# EAGLE design SpiCurrent-wimpy (EAGLE 7.2.0)
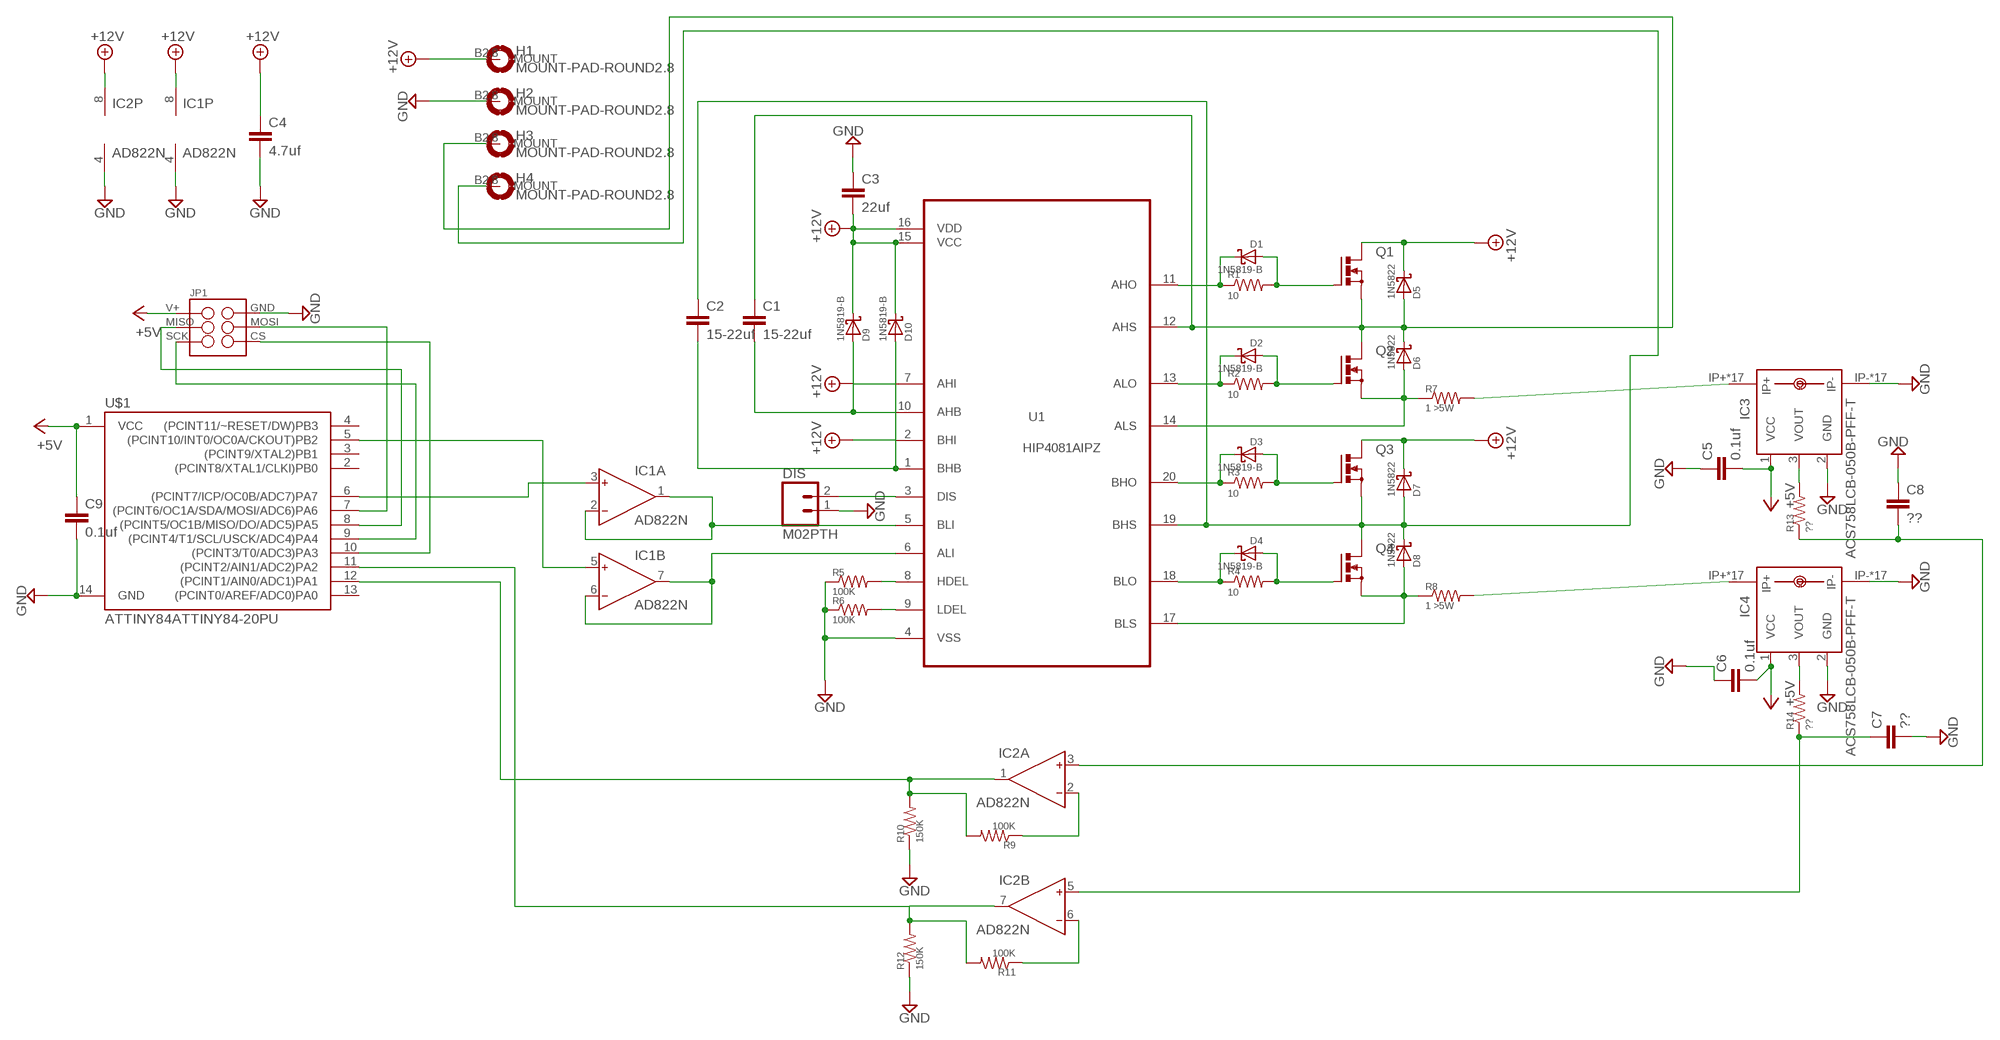
[diagram p0: schematic, sheet 1]

## Parts
C1  15-22uf  C-EU050-055X075  [C050-055X075]
C2  15-22uf  C-EU050-055X075  [C050-055X075]
C3  22uf  C-EU050-055X075  [C050-055X075]
C4  4.7uf  C-EU050-055X075  [C050-055X075]
C5  0.1uf  C-EU050-055X075  [C050-055X075]
C6  0.1uf  C-EU050-055X075  [C050-055X075]
C7  ??  C-EU050-055X075  [C050-055X075]
C8  ??  C-EU050-055X075  [C050-055X075]
C9  0.1uf  C-EU050-055X075  [C050-055X075]
D1  1N5819-B  [DO41-7.6]
D2  1N5819-B  [DO41-7.6]
D3  1N5819-B  [DO41-7.6]
D4  1N5819-B  [DO41-7.6]
D5  1N5822  1N5819-B  [DO41-7.6]
D6  1N5822  1N5819-B  [DO41-7.6]
D7  1N5822  1N5819-B  [DO41-7.6]
D8  1N5822  1N5819-B  [DO41-7.6]
D9  1N5819-B  [DO41-7.6]
D10  1N5819-B  [DO41-7.6]
DIS  M02PTH  [1X02]
H1  MOUNT-PAD-ROUND2.8  [2,8-PAD]
H2  MOUNT-PAD-ROUND2.8  [2,8-PAD]
H3  MOUNT-PAD-ROUND2.8  [2,8-PAD]
H4  MOUNT-PAD-ROUND2.8  [2,8-PAD]
IC1  AD822N  [DIL08]
IC2  AD822N  [DIL08]
IC3  ACS758LCB-050B-PFF-T  [CB-PFF]
IC4  ACS758LCB-050B-PFF-T  [CB-PFF]
JP1  M03X2SHROUD  [2X3-SPI-SHROUDED]
Q1  PMOSFET_NTO220BV  [TO220BV]
Q2  PMOSFET_NTO220BV  [TO220BV]
Q3  PMOSFET_NTO220BV  [TO220BV]
Q4  PMOSFET_NTO220BV  [TO220BV]
R1  10  R-US_0207/10  [0207/10]
R2  10  R-US_0207/10  [0207/10]
R3  10  R-US_0207/10  [0207/10]
R4  10  R-US_0207/10  [0207/10]
R5  100K  R-US_0207/10  [0207/10]
R6  100K  R-US_0207/10  [0207/10]
R7  1 >5W  R-US_VTA54  [VTA54]
R8  1 >5W  R-US_VTA54  [VTA54]
R9  100K  R-US_0207/10  [0207/10]
R10  150K  R-US_0207/10  [0207/10]
R11  100K  R-US_0207/10  [0207/10]
R12  150K  R-US_0207/10  [0207/10]
R13  ??  R-US_0207/10  [0207/10]
R14  ??  R-US_0207/10  [0207/10]
U1  HIP4081AIPZ  [DIP254P762X533-20]
U$1  ATTINY84ATTINY84-20PU  [DIL14]

## Nets
+5V: C5.2 C6.2 C9.1 IC3.1(VCC) IC4.1(VCC) JP1.1 U$1.1(VCC)
+12V: C3.2 C4.1 D5.C D7.C D9.C D10.C H1.B2,8(MOUNT) IC1.8(P:V+) IC2.8(P:V+) Q1.D Q3.D U1.2(BHI) U1.7(AHI) U1.15(VCC) U1.16(VDD)
,JHBKLJN: C1.1 D5.A D6.C H3.B2,8(MOUNT) Q1.S Q2.D U1.12(AHS)
GND: C3.1 C4.2 C5.1 C6.1 C7.2 C8.1 C9.2 DIS.1 H2.B2,8(MOUNT) IC1.4(P:V-) IC2.4(P:V-) IC3.2(GND) IC3.IP- IC3.IP-@2(IP-) IC3.IP-@3(IP-) IC3.IP-@4(IP-) IC3.IP-@5(IP-) IC3.IP-@6(IP-) IC3.IP-@7(IP-) IC3.IP-@8(IP-) IC3.IP-@9(IP-) IC3.IP-@10(IP-) IC3.IP-@11(IP-) IC3.IP-@12(IP-) IC3.IP-@13(IP-) IC3.IP-@14(IP-) IC3.IP-@15(IP-) IC3.IP-@16(IP-) IC3.IP-@17(IP-) IC4.2(GND) IC4.IP- IC4.IP-@2(IP-) IC4.IP-@3(IP-) IC4.IP-@4(IP-) IC4.IP-@5(IP-) IC4.IP-@6(IP-) IC4.IP-@7(IP-) IC4.IP-@8(IP-) IC4.IP-@9(IP-) IC4.IP-@10(IP-) IC4.IP-@11(IP-) IC4.IP-@12(IP-) IC4.IP-@13(IP-) IC4.IP-@14(IP-) IC4.IP-@15(IP-) IC4.IP-@16(IP-) IC4.IP-@17(IP-) JP1.2 R5.1 R6.1 R10.1 R12.1 U1.4(VSS) U$1.14(GND)
N$1: IC1.1(A:OUT) IC1.2(A:IN-) U1.5(BLI)
N$2: IC1.6(B:IN-) IC1.7(B:OUT) U1.6(ALI)
N$3: D3.C R3.1 U1.20(BHO)
N$4: D3.A Q3.G R3.2
N$5: D4.C R4.1 U1.18(BLO)
N$6: D4.A Q4.G R4.2
N$7: D2.C R2.1 U1.13(ALO)
N$8: D2.A Q2.G R2.2
N$9: D1.C R1.1 U1.11(AHO)
N$10: D1.A Q1.G R1.2
N$12: R5.2 U1.8(HDEL)
N$13: R6.2 U1.9(LDEL)
N$14: C2.1 D7.A D8.C H4.B2,8(MOUNT) Q3.S Q4.D U1.19(BHS)
N$15: D6.A Q2.S R7.1 U1.14(ALS)
N$16: D8.A Q4.S R8.1 U1.17(BLS)
N$17: C1.2 D9.A U1.10(AHB)
N$18: C2.2 D10.A U1.1(BHB)
N$19: DIS.2 U1.3(DIS)
N$20: JP1.4 U$1.7((PCINT6/OC1A/SDA/MOSI/ADC6)PA6)
N$21: JP1.3 U$1.8((PCINT5/OC1B/MISO/DO/ADC5)PA5)
N$22: JP1.5 U$1.9((PCINT4/T1/SCL/USCK/ADC4)PA4)
N$23: JP1.6 U$1.10((PCINT3/T0/ADC3)PA3)
N$24: IC1.5(B:IN+) U$1.5((PCINT10/INT0/OC0A/CKOUT)PB2)
N$25: IC1.3(A:IN+) U$1.6((PCINT7/ICP/OC0B/ADC7)PA7)
N$26: IC2.2(A:IN-) R9.1
N$27: IC4.IP+ IC4.IP+@2(IP+) IC4.IP+@3(IP+) IC4.IP+@4(IP+) IC4.IP+@5(IP+) IC4.IP+@6(IP+) IC4.IP+@7(IP+) IC4.IP+@8(IP+) IC4.IP+@9(IP+) IC4.IP+@10(IP+) IC4.IP+@11(IP+) IC4.IP+@12(IP+) IC4.IP+@13(IP+) IC4.IP+@14(IP+) IC4.IP+@15(IP+) IC4.IP+@16(IP+) IC4.IP+@17(IP+) R8.2
N$28: IC2.1(A:OUT) R9.2 R10.2 U$1.12((PCINT1/AIN0/ADC1)PA1)
N$29: IC2.7(B:OUT) R11.2 R12.2 U$1.11((PCINT2/AIN1/ADC2)PA2)
N$30: IC2.6(B:IN-) R11.1
N$31: IC3.IP+ IC3.IP+@2(IP+) IC3.IP+@3(IP+) IC3.IP+@4(IP+) IC3.IP+@5(IP+) IC3.IP+@6(IP+) IC3.IP+@7(IP+) IC3.IP+@8(IP+) IC3.IP+@9(IP+) IC3.IP+@10(IP+) IC3.IP+@11(IP+) IC3.IP+@12(IP+) IC3.IP+@13(IP+) IC3.IP+@14(IP+) IC3.IP+@15(IP+) IC3.IP+@16(IP+) IC3.IP+@17(IP+) R7.2
N$32: C8.2 IC2.3(A:IN+) R13.1
N$33: C7.1 IC2.5(B:IN+) R14.1
N$34: IC3.3(VOUT) R13.2
N$35: IC4.3(VOUT) R14.2
Unconnected: U$1.2((PCINT8/XTAL1/CLKI)PB0) U$1.3((PCINT9/XTAL2)PB1) U$1.4((PCINT11/~RESET/DW)PB3) U$1.13((PCINT0/AREF/ADC0)PA0)

## Library data of the parts
C1-C9 = rcl:C-EU: CAPACITOR, European symbol
D1-D10 = diode-custom:1N581*: 1.0A SCHOTTKY BARRIER RECTIFIER Source: http://www.diodes.com/datasheets/ds23001.pdf
DIS = SparkFun-Connectors:M02: Standard 2-pin 0.1" header. Use with - straight break away headers ( PRT-00116) - right angle break away headers (PRT-00553) - swiss pins (PRT-00743) - machine pins (PRT-00117) - female headers (PRT-00115) Molex polarized connector foot print use with: PRT-08233 with associated crimp pins and housings. 2.54_SCREWTERM for use with PRT-10571. 3.5mm Screw Terminal footprints for PRT-08084 5mm Screw Terminal footprints for use with PRT-08432
H1-H4 = holes-custom:MOUNT-PAD-ROUND: MOUNTING PAD, round
IC1 IC2 = analog-devices:AD822: Single-Supply, Rail-to-Rail Low Power FET-Input Op Amp Source: http://www.analog.com/static/imported-files/data_sheets/AD822.pdf; OC_FARNELL: 1438581; OC_NEWARK: unknown
IC3 IC4 = allegro:ACS758*: Thermally Enhanced, Fully Integrated, Hall Effect-Based Linear Current Sensor with 100 micro Ohm Current Conductor display layer 49 Reference in BRD and place VIAs on circles Source: http://www.allegromicro.com/en/Products/Part_Numbers/0758/0758.pdf; MPN: ACS758LCB-050B-PFF-T; OC_FARNELL: 1718997; OC_NEWARK: 04R7131
JP1 = CustomParts:M03X2: 2x3 .1" header. Shrouded, with keying- CONN-10681 SMT- CONN-11415 Pogo pins- HW-11044; PROD_ID: CONN-10681
Q1-Q4 = transistor-power:PMOSFET_N: Power MOSFET N-Channel
R1-R4 = resistor:R-US_: RESISTOR, American symbol
R5-R14 = resistor-custom:R-US_: RESISTOR, American symbol
U1 = Intersil_By_element14_Batch_1:HIP4081AIPZ: Bridge FET Driver; MPN: HIP4081AIPZ; OC_FARNELL: 9664130; OC_NEWARK: 57K3817; PACKAGE: DIP-20; SUPPLIER: INTERSIL
U$1 = SparkFun-DigitalIC:ATTINY84: Atmel 14-pin 2/4/8kB flash uC

## Board
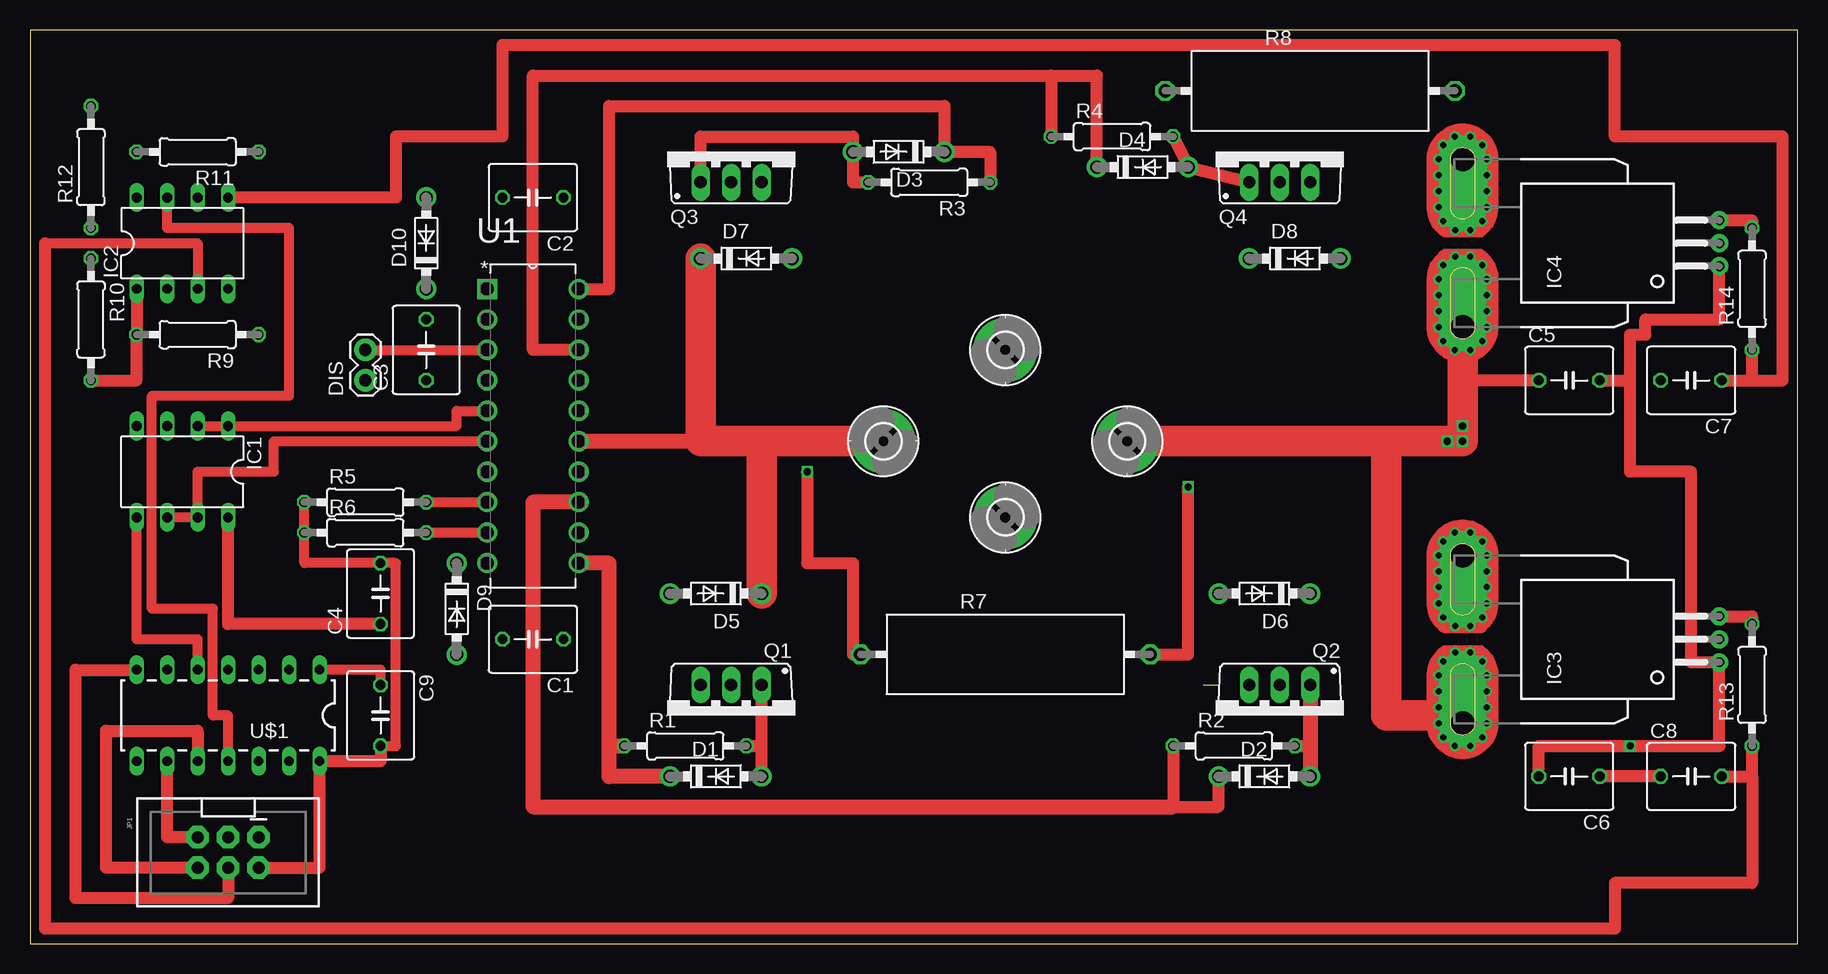
[diagram p1: board, top side]
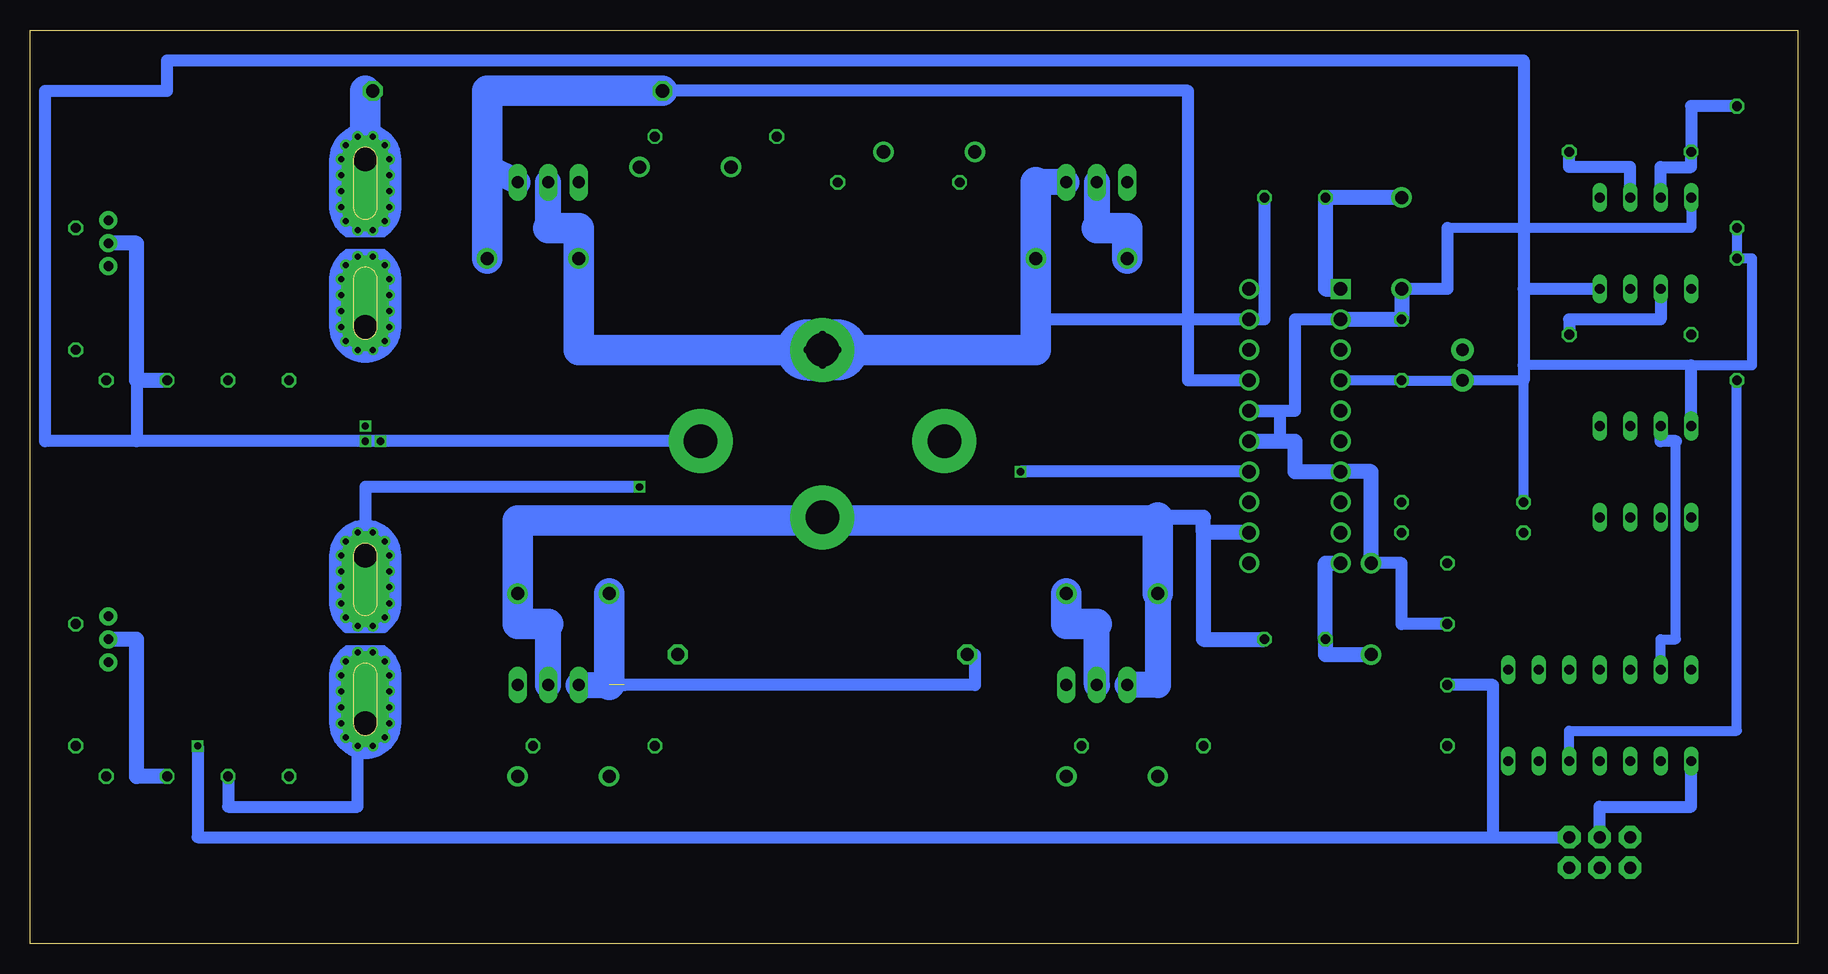
[diagram p2: board, bottom side, seen from below]

Size 147.32 x 76.2 mm. Coordinates in mm from the lower left corner, seen from the top.
Outline: 0,0 147.32,0 147.32,76.2 0,76.2 0,0
Copper layers (1*16): Top 0.0356mm / dielectric 1.5011mm / Bottom 0.0356mm
Design rules "LaenPCBOrder-bigtesting": minimum track width 10mil, minimum drill 13mil, track to track 10mil, track to pad 10mil, pad to pad 10mil, via to via 10mil, smd to smd 10mil, copper to edge 15mil, drill to drill 6mil, minimum pad ring 7mil, minimum via ring 7mil, stop-mask expansion 3mil, vias tented up to drill 0mil, thermal gap 20mil

### Footprints (pad centres in the part's own frame; a part is rotated, then mirrored left to right if it is on the bottom)
C050-055X075 = drill 0.813 octagon: 1 -2.54,0; 2 2.54,0
DO41-7.6 = drill 1.1 pad 1.7: A 3.81,0; C -3.81,0
1X02 = drill 1.016 pad 1.88: 1 0,0; 2 2.54,0
2,8-PAD = drill 2.8 pad 5.334: B2,8 0,0
DIL08 = drill 0.813 long: 1 -3.81,-3.81; 2 -1.27,-3.81; 3 1.27,-3.81; 4 3.81,-3.81; 5 3.81,3.81; 6 1.27,3.81; 7 -1.27,3.81; 8 -3.81,3.81
CB-PFF = drill 0.8 pad 1.5: 1 -1.91,-21.4; 2 0,-21.4; 3 1.91,-21.4 | drill 2 pad 4 offset: IP+ 7,0; IP- -7,0 | drill 0.5 pad 0.9: IP+@2 8.89,0.635; IP+@3 8.89,-0.635; IP+@4 8.175,-1.625; IP+@5 7,-2; IP+@6 5.675,-2; IP+@7 4.35,-2; IP+@8 3,-2; IP+@9 1.825,-1.625; IP+@10 1.1,-0.625; IP+@11 1.1,0.625; IP+@12 1.825,1.625; IP+@13 3,2; IP+@14 4.35,2; IP+@15 5.675,2; IP+@16 7,2; IP+@17 8.175,1.625; IP-@2 -8.89,0.635; IP-@3 -8.89,-0.635; IP-@4 -8.175,-1.625; IP-@5 -7,-2; IP-@6 -5.675,-2; IP-@7 -4.325,-2; IP-@8 -3,-2; IP-@9 -1.825,-1.625; IP-@10 -1.1,-0.625; IP-@11 -1.1,0.625; IP-@12 -1.825,1.625; IP-@13 -3,2; IP-@14 -4.325,2; IP-@15 -5.675,2; IP-@16 -7,2; IP-@17 -8.175,1.625
2X3-SPI-SHROUDED = drill 1.016 pad 1.88 octagon: 1 -1.27,2.54; 2 1.27,2.54; 3 -1.27,0; 4 1.27,0; 5 -1.27,-2.54; 6 1.27,-2.54
TO220BV = drill 1.016 long: D 0,-2.54; G -2.54,-2.54; S 2.54,-2.54
0207/10 = drill 0.813 octagon: 1 -5.08,0; 2 5.08,0
VTA54 = drill 1.1 octagon: 1 -12.065,0; 2 12.065,0
DIP254P762X533-20 = drill 1.118 square: 1 -7.62,22.86 | drill 1.118: 2 -7.62,20.32; 3 -7.62,17.78; 4 -7.62,15.24; 5 -7.62,12.7; 6 -7.62,10.16; 7 -7.62,7.62; 8 -7.62,5.08; 9 -7.62,2.54; 10 -7.62,0; 11 0,0; 12 0,2.54; 13 0,5.08; 14 0,7.62; 15 0,10.16; 16 0,12.7; 17 0,15.24; 18 0,17.78; 19 0,20.32; 20 0,22.86
DIL14 = drill 0.813 long: 1 -8.89,-3.81; 2 -6.35,-3.81; 3 -3.81,-3.81; 4 -1.27,-3.81; 5 1.27,-3.81; 6 3.81,-3.81; 7 6.35,-3.81; 8 6.35,3.81; 9 3.81,3.81; 10 1.27,3.81; 11 -1.27,3.81; 12 -3.81,3.81; 13 -6.35,3.81; 14 -8.89,3.81

### Placement (x,y rotation side)
C1  41.91,25.4 180 top
C2  41.91,62.23 180 top
C3  33.02,49.53 90 top
C4  29.21,29.21 90 top
C5  128.27,46.99 0 top
C6  128.27,13.97 180 top
C7  138.43,46.99 180 top
C8  138.43,13.97 0 top
C9  29.21,19.05 270 top
D1  57.15,13.97 0 top
D2  102.87,13.97 0 top
D3  72.39,66.04 180 top
D4  92.71,64.77 0 top
D5  57.15,29.21 180 top
D6  102.87,29.21 180 top
D7  59.69,57.15 0 top
D8  105.41,57.15 0 top
D9  35.56,27.94 270 top
D10  33.02,58.42 90 top
DIS  27.94,46.99 90 top
H1  71.12,41.91 270 top
H2  91.44,41.91 180 top
H3  81.28,35.56 0 top
H4  81.28,49.53 0 top
IC1  12.7,39.37 180 top
IC2  12.7,58.42 0 top
IC3  119.38,25.4 90 top
IC4  119.38,58.42 90 top
JP1  16.51,7.62 270 top
Q1  58.42,19.05 180 top
Q2  104.14,19.05 180 top
Q3  58.42,66.04 0 top
Q4  104.14,66.04 0 top
R1  54.61,16.51 0 top
R2  100.33,16.51 0 top
R3  74.93,63.5 180 top
R4  90.17,67.31 0 top
R5  27.94,36.83 0 top
R6  27.94,34.29 0 top
R7  81.28,24.13 0 top
R8  106.68,71.12 0 top
R9  13.97,50.8 180 top
R10  5.08,52.07 270 top
R11  13.97,66.04 180 top
R12  5.08,64.77 90 top
R13  143.51,21.59 90 top
R14  143.51,54.61 90 top
U1  45.72,31.75 0 top
U$1  15.24,19.05 180 top

### Tracks (layer width: path | path; a pad name or v marks a point on that pad's centre or on a via)
+5V  (via drill 0.6)
  Top 0.813: C9.1 29.21,22.86 U$1.1
  Top 1.016: IC4.1 140.78,52.07 134.62,52.07 134.62,50.8 133.35,50.8 133.35,46.99 | C6.2 125.73,16.51 v133.35,16.51 140.78,16.51 IC3.1 138.43,23.49 138.43,39.37 133.35,39.37 133.35,46.99 | C5.2 133.35,46.99
  Bottom 1.016: v133.35,16.51 133.35,8.89 25.4,8.89 | 25.4,8.89 JP1.1 | 25.4,8.89 25.4,21.59 C9.1
+12V
  Top 1.016: C4.1 16.51,26.67 IC1.8
  Top 1.27: U1.15 55.88,41.91
  Top 2.54: D5.C 60.96,41.91 | 60.96,41.91 H1.B2,8 | 60.96,41.91 55.88,41.91 D7.C
  Bottom 0.813: IC2.8 8.89,59.69 29.21,59.69
  Bottom 1.016: C4.1 33.02,26.67 33.02,31.75 D9.C | U1.2 41.91,52.07 41.91,44.45 U1.16 43.18,44.45 43.18,41.91 | 29.21,59.69 29.21,54.61 D10.C
  Bottom 1.27: U1.15 43.18,41.91 41.91,41.91 41.91,39.37 U1.7 35.56,39.37 D9.C | U1.2 C3.2 D10.C
  Bottom 2.184: Q3.D 58.42,59.69 | Q1.D 58.42,26.67
  Bottom 2.54: 58.42,59.69 55.88,59.69 D7.C | 58.42,26.67 60.96,26.67 D5.C
,JHBKLJN  (via drill 0.6)
  Bottom 1.016: H3.B2,8 101.6,35.56 101.6,35.3
  Bottom 1.27: U1.12 49.53,34.29 | 49.53,34.29 49.53,25.4 C1.1 | 49.53,34.29 49.53,35.56 53.34,35.56
  Bottom 2.184: D5.A 53.34,21.59 Q1.S | Q2.D 104.14,26.67
  Bottom 2.54: 104.14,26.67 106.68,26.67 D6.C 106.68,35.3 101.6,35.3 53.34,35.3 | 53.34,35.56 53.34,35.3 | 53.34,35.3 D5.A
  other vias: 81.28,35.56
GND  (via drill 0.6)
  Top 0.813: R5.1 R6.1 22.86,31.75 C4.2 30.48,31.75 30.48,16.51 C9.2
  Top 1.016: C8.1 C6.1 | C9.2 29.21,15.24 U$1.14 24.13,6.35 JP1.2 | C5.1 119.38,46.99
  Top 2.54: H2.B2,8 113.03,41.91 | IC4.IP- 119.38,46.99 v119.38,43.18 v119.38,41.91 v118.11,41.91 113.03,41.91 | 113.03,41.91 113.03,19.05 119.38,19.05 IC3.IP-
  Bottom 0.813: R5.1 22.86,46.99 DIS.1 C3.1 U1.4 | R12.1 R10.1 3.81,57.15 3.81,48.26 8.89,48.26 22.86,48.26
  Bottom 1.016: C6.1 130.81,11.43 120.02,11.43 IC3.IP-@3 | H2.B2,8 138.43,41.91 | 138.43,41.91 146.05,41.91 146.05,71.12 135.89,71.12 135.89,73.66 22.86,73.66 22.86,54.61 | 22.86,54.61 22.86,48.26 22.86,46.99 | IC2.4 22.86,54.61 | IC1.4 8.89,48.26 | 138.43,46.99 138.43,41.91
  Bottom 1.27: C7.2 138.43,46.99 138.43,58.42 IC4.2 | C8.1 138.43,13.97 138.43,25.4 IC3.2
N$1
  Top 0.813: IC1.2 IC1.1 35.56,43.18 35.56,44.45 U1.5
N$2
  Top 0.813: U1.6 20.32,41.91 20.32,39.37 13.97,39.37 IC1.7 IC1.6
N$3
  Top 1.016: R3.1 80.01,66.04 D3.C 76.2,69.85 48.26,69.85 48.26,54.61 U1.20
N$4
  Top 1.016: Q3.G 55.88,67.31 68.58,67.31 D3.A 68.58,63.5 R3.2
N$5
  Top 1.016: D4.C 88.9,72.39 85.09,72.39 | 85.09,72.39 R4.1 | U1.18 41.91,49.53 41.91,72.39 85.09,72.39
N$6
  Top 1.016: Q4.G D4.A R4.2
N$7
  Top 1.016: D2.C 99.06,11.43 95.25,11.43 R2.1
  Top 1.27: U1.13 41.91,36.83 41.91,11.43 95.25,11.43
N$8
  Top 1.016: R2.2 106.68,16.51
  Top 1.27: Q2.G 106.68,16.51 D2.A
N$9
  Top 1.27: 48.26,16.51 48.26,13.97 D1.C | 48.26,16.51 R1.1 | 48.26,16.51 48.26,31.75 U1.11
N$10
  Top 1.016: R1.2 60.96,16.51 | 60.96,16.51 Q1.G | D1.A 60.96,16.51
N$12
  Top 0.813: R5.2 U1.8
N$13
  Top 0.813: R6.2 U1.9
N$14  (via drill 0.6)
  Bottom 1.016: C2.1 44.45,52.07 U1.19 63.5,52.07 63.5,52.33
  Bottom 2.184: 104.14,59.69 Q4.D | Q3.S 63.5,63.5
  Bottom 2.54: 104.14,59.69 101.6,59.69 D8.C 101.6,49.53 v82.55,49.53 | 63.5,63.5 D7.A 63.5,52.33 63.5,49.53 v80.01,49.53
  Bottom 5.08: v80.01,49.53 H4.B2,8 v82.55,49.53
  other vias: 81.28,49.53
N$15  (via drill 0.6)  (1 unrouted)
  Top 1.016: v64.77,39.37 64.77,31.75 68.58,31.75 68.58,24.13 R7.1
  Bottom 1.016: U1.14 v64.77,39.37 | R7.1 68.58,24.13 68.58,21.59 97.79,21.59
  Bottom 2.184: Q2.S 99.06,21.59
  Bottom 2.54: 99.06,21.59 D6.A
N$16
  Bottom 1.016: U1.17 50.8,46.99 50.8,71.12 R8.1
  Bottom 2.184: Q4.S 109.22,64.77
  Bottom 2.54: D8.A 109.22,64.77 109.22,71.12 R8.1
N$17
  Bottom 1.27: U1.10 39.37,31.75 C1.2 39.37,24.13 D9.A
N$18
  Bottom 1.27: U1.1 39.37,54.61 C2.2 D10.A
N$19
  Top 0.813: DIS.2 U1.3
N$20
  Top 1.016: JP1.4 16.51,3.81 3.81,3.81 3.81,22.86 U$1.7
N$21
  Bottom 1.016: JP1.3 16.51,11.43 8.89,11.43 U$1.8
N$22
  Top 1.016: JP1.5 11.43,8.89 U$1.9
N$23
  Top 1.016: JP1.6 6.35,6.35 6.35,17.78 13.97,17.78 U$1.10
N$24
  Top 0.813: U$1.5 13.97,25.4 8.89,25.4 IC1.5
N$25
  Bottom 0.813: U$1.6 11.43,25.4 10.16,25.4 10.16,41.91
  Bottom 1.016: 10.16,41.91 11.43,41.91 IC1.3
N$26
  Bottom 1.016: IC2.2 11.43,52.07 19.05,52.07 R9.1
N$27
  Top 2.54: 119.38,64.14 IC4.IP+
  Bottom 1.016: R8.2 119.38,71.12
  Bottom 2.54: 119.38,71.12 IC4.IP+
N$28
  Top 1.016: IC2.1 R9.2 8.89,46.99 R10.2
  Bottom 0.813: U$1.12 19.05,17.78 5.08,17.78 R10.2
N$29
  Top 0.813: U$1.11 16.51,19.05 15.24,19.05 15.24,27.94 10.16,27.94 10.16,45.72 21.59,45.72 21.59,59.69 11.43,59.69 IC2.7
  Bottom 1.016: R12.2 8.89,69.85 R11.2 8.89,64.77 11.43,64.77 IC2.7
N$30
  Bottom 1.016: IC2.6 13.97,64.77 19.05,64.77 R11.1
N$31  (via drill 0.6)
  Top 1.016: R7.2 96.52,24.13 v96.52,38.1
  Bottom 1.016: v96.52,38.1 119.38,38.1 IC3.IP+
N$32
  Top 0.813: 1.27,58.42 13.97,58.42 IC2.3
  Top 1.016: 143.51,13.97 R13.1 | C8.2 143.51,13.97 | 143.51,13.97 143.51,5.08 132.08,5.08 132.08,1.27 1.27,1.27 1.27,58.42
N$33
  Top 1.016: R14.1 143.51,46.99 C7.1 146.05,46.99 146.05,67.31 132.08,67.31 132.08,74.93 39.37,74.93 39.37,67.31 30.48,67.31 30.48,62.23 IC2.5
N$34
  Top 1.016: IC3.3 143.51,27.31 R13.2
N$35
  Top 1.016: IC4.3 143.51,60.33 R14.2
N$36  (via drill 0.6)
  other vias: 81.28,50.8
N$37  (via drill 0.6)
  other vias: 81.28,48.26